# EAGLE design USB Experiment Board (EAGLE 7.6.0)
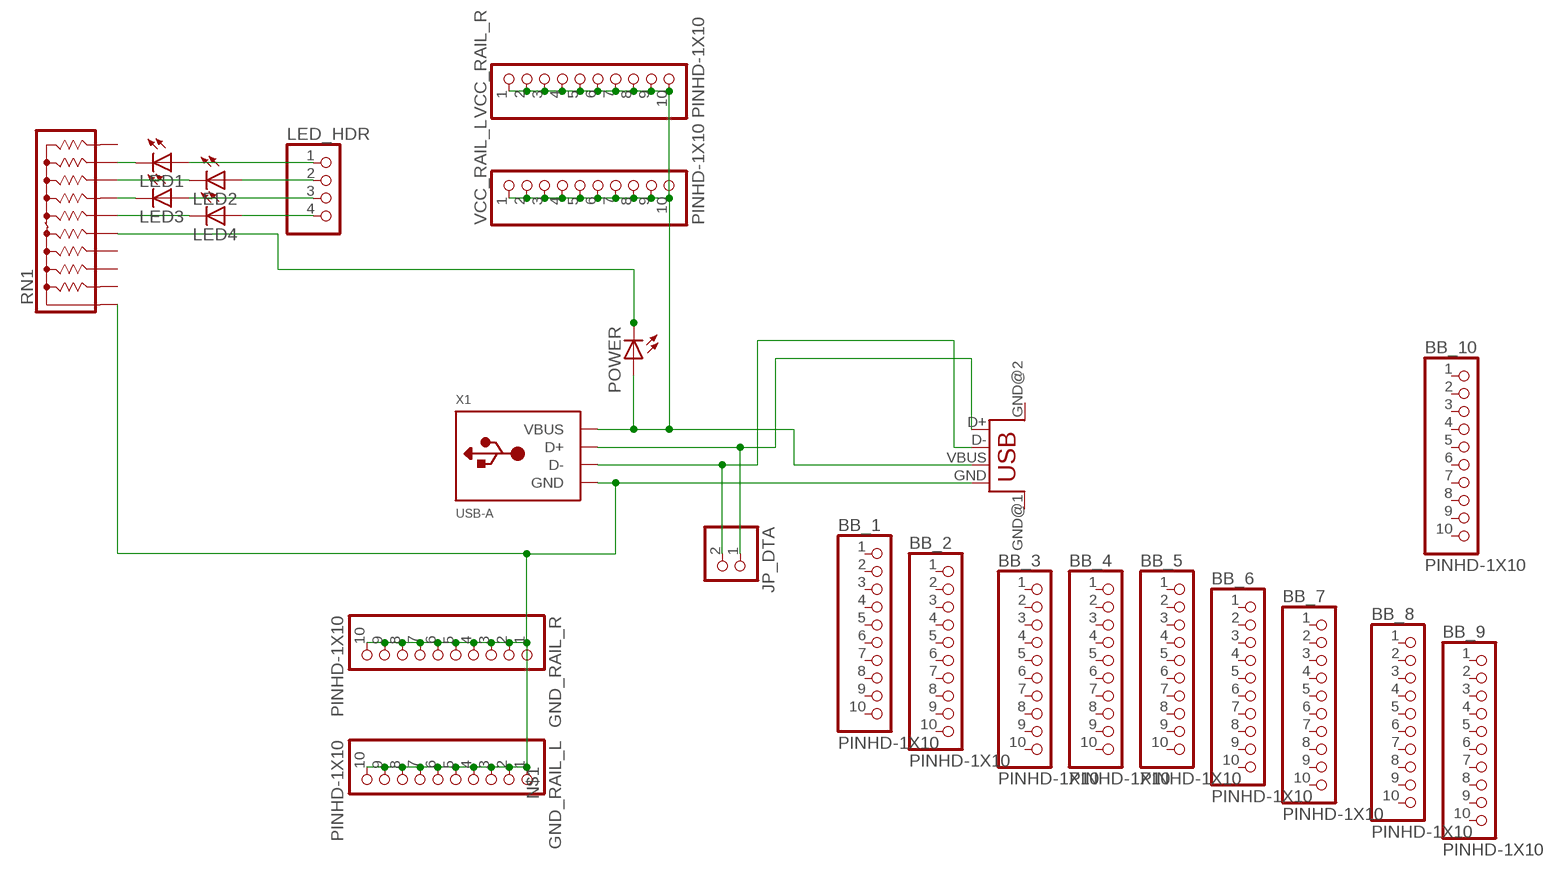
[diagram p0: schematic, sheet 1]

## Parts
BB_1  PINHD-1X10  [1X10-BIG]
BB_2  PINHD-1X10  [1X10-BIG]
BB_3  PINHD-1X10  [1X10-BIG]
BB_4  PINHD-1X10  [1X10-BIG]
BB_5  PINHD-1X10  [1X10-BIG]
BB_6  PINHD-1X10  [1X10-BIG]
BB_7  PINHD-1X10  [1X10-BIG]
BB_8  PINHD-1X10  [1X10-BIG]
BB_9  PINHD-1X10  [1X10-BIG]
BB_10  PINHD-1X10  [1X10-BIG]
GND_RAIL_L  PINHD-1X10  [1X10-BIG]
GND_RAIL_R  PINHD-1X10  [1X10-BIG]
JP_DTA  PINHD-1X2  [1X02]
LED1  LEDSMT1206  [1206]
LED2  LEDSMT1206  [1206]
LED3  LEDSMT1206  [1206]
LED4  LEDSMT1206  [1206]
LED_HDR  PINHD-1X4  [1X04]
POWER  LEDSMT1206  [1206]
RN1  4610X  [SIP10]
U$1  USB  [USB-FEMALE-A-PTH]
VCC_RAIL_L  PINHD-1X10  [1X10-BIG]
VCC_RAIL_R  PINHD-1X10  [1X10-BIG]
X1  USB-A  [MOLEX_480371000]

## Nets
N$1: GND_RAIL_L.1 GND_RAIL_L.2 GND_RAIL_L.3 GND_RAIL_L.4 GND_RAIL_L.5 GND_RAIL_L.6 GND_RAIL_L.7 GND_RAIL_L.8 GND_RAIL_L.9 GND_RAIL_L.10 GND_RAIL_R.1 GND_RAIL_R.2 GND_RAIL_R.3 GND_RAIL_R.4 GND_RAIL_R.5 GND_RAIL_R.6 GND_RAIL_R.7 GND_RAIL_R.8 GND_RAIL_R.9 GND_RAIL_R.10 RN1.1 U$1.GND X1.4(GND)
N$2: LED1.C RN1.9
N$3: JP_DTA.1 U$1.D+ X1.3(D+)
N$4: JP_DTA.2 U$1.D- X1.2(D-)
N$5: LED2.C RN1.8
N$6: LED3.C RN1.7
N$7: LED4.C RN1.6
N$8: LED1.A LED_HDR.1
N$9: LED2.A LED_HDR.2
N$10: LED3.A LED_HDR.3
N$11: LED4.A LED_HDR.4
N$13: POWER.C RN1.5
VCC: POWER.A U$1.VBUS VCC_RAIL_L.1 VCC_RAIL_L.2 VCC_RAIL_L.3 VCC_RAIL_L.4 VCC_RAIL_L.5 VCC_RAIL_L.6 VCC_RAIL_L.7 VCC_RAIL_L.8 VCC_RAIL_L.9 VCC_RAIL_L.10 VCC_RAIL_R.1 VCC_RAIL_R.2 VCC_RAIL_R.3 VCC_RAIL_R.4 VCC_RAIL_R.5 VCC_RAIL_R.6 VCC_RAIL_R.7 VCC_RAIL_R.8 VCC_RAIL_R.9 VCC_RAIL_R.10 X1.1(VBUS)
Unconnected: BB_1.1 BB_1.2 BB_1.3 BB_1.4 BB_1.5 BB_1.6 BB_1.7 BB_1.8 BB_1.9 BB_1.10 BB_2.1 BB_2.2 BB_2.3 BB_2.4 BB_2.5 BB_2.6 BB_2.7 BB_2.8 BB_2.9 BB_2.10 BB_3.1 BB_3.2 BB_3.3 BB_3.4 BB_3.5 BB_3.6 BB_3.7 BB_3.8 BB_3.9 BB_3.10 BB_4.1 BB_4.2 BB_4.3 BB_4.4 BB_4.5 BB_4.6 BB_4.7 BB_4.8 BB_4.9 BB_4.10 BB_5.1 BB_5.2 BB_5.3 BB_5.4 BB_5.5 BB_5.6 BB_5.7 BB_5.8 BB_5.9 BB_5.10 BB_6.1 BB_6.2 BB_6.3 BB_6.4 BB_6.5 BB_6.6 BB_6.7 BB_6.8 BB_6.9 BB_6.10 BB_7.1 BB_7.2 BB_7.3 BB_7.4 BB_7.5 BB_7.6 BB_7.7 BB_7.8 BB_7.9 BB_7.10 BB_8.1 BB_8.2 BB_8.3 BB_8.4 BB_8.5 BB_8.6 BB_8.7 BB_8.8 BB_8.9 BB_8.10 BB_9.1 BB_9.2 BB_9.3 BB_9.4 BB_9.5 BB_9.6 BB_9.7 BB_9.8 BB_9.9 BB_9.10 BB_10.1 BB_10.2 BB_10.3 BB_10.4 BB_10.5 BB_10.6 BB_10.7 BB_10.8 BB_10.9 BB_10.10 RN1.2 RN1.3 RN1.4 RN1.10 U$1.GND@1(GND) U$1.GND@2(GND)

## Library data of the parts
BB_1-BB_10 GND_RAIL_L GND_RAIL_R VCC_RAIL_L VCC_RAIL_R = adafruit:PINHD-1X10: Pin header 1x10 0.1" spacing With round pins
JP_DTA = pinhead:PINHD-1X2: PIN HEADER
LED1-LED4 POWER = adafruit:LED: LED OSRAM: - CHIPLED LG R971, LG N971, LY N971, LG Q971, LY Q971, LO R971, LY R971 LH N974, LH R974 LS Q976, LO Q976, LY Q976 LO Q996 - Hyper CHIPLED LW Q18S LB Q993, LB Q99A, LB R99A - SideLED LS A670, LO A670, LY A670, LG A670, LP A670 LB A673, LV A673, LT A673, LW A673 LH A674 LY A675 LS A676, LA A676, LO A676, LY A676, LW A676 LS A679, LY A679, LG A679 - Hyper Micro SIDELED® LS Y876, LA Y876, LO Y876, LY Y876 LT Y87S - SmartLED LW L88C, LW L88S LB L89C, LB L89S, LG L890 LS L89K, LO L89K, LY L89K LS L896, LA L896, LO L896, LY L896 - TOPLED LS T670, LO T670, LY T670, LG T670, LP T670 LSG T670, LSP T670, LSY T670, LOP T670, LYG T670 LG T671, LOG T671, LSG T671 LB T673, LV T673, LT T673, LW T673 LH T674 LS T676, LA T676, LO T676, LY T676, LB T676, LH T676, LSB T676, LW T676 LB T67C, LV T67C, LT T67C, LS T67K, LO T67K, LY T67K, LW E67C LS E67B, LA E67B, LO E67B, LY E67B, LB E67C, LV E67C, LT E67C LW T67C LS T679, LY T679, LG T679 LS T770, LO T770, LY T770, LG T770, LP T770 LB T773, LV T773, LT T773, LW T773 LH T774 LS E675, LA E675, LY E675, LS T675 LS T776, LA T776, LO T776, LY T776, LB T776 LHGB T686 LT T68C, LB T68C - Hyper Mini TOPLED® LB M676 - Mini TOPLED Santana® LG M470 LS M47K, LO M47K, LY M47K Source: http://www.osram.convergy.de/
LED_HDR = pinhead:PINHD-1X4: PIN HEADER
RN1 = resistor-sip:4610X: Bourns 4600X Series - Thick Film Conformal SIPs 4610X-101 Resistor Network Configuration: 101 (Bussed Resistors) Resistance range: 10 ohms to 10 Megaohms Maximum Operating Voltage: 100V Source: http://www.bourns.com/ProductLine.aspx?name=standard_thick_film_networks PDF: http://www.bourns.com/data/global/pdfs/4600X.pdf
U$1 = STUNTAZ:USB: USB Connectors USB-FEMALE-A-PTH: Through hole Female Type A Connector
X1 = adafruit:USB-A: USB type A 'plug' Used for things that can directly connect to a USB port, say USB key

## Board
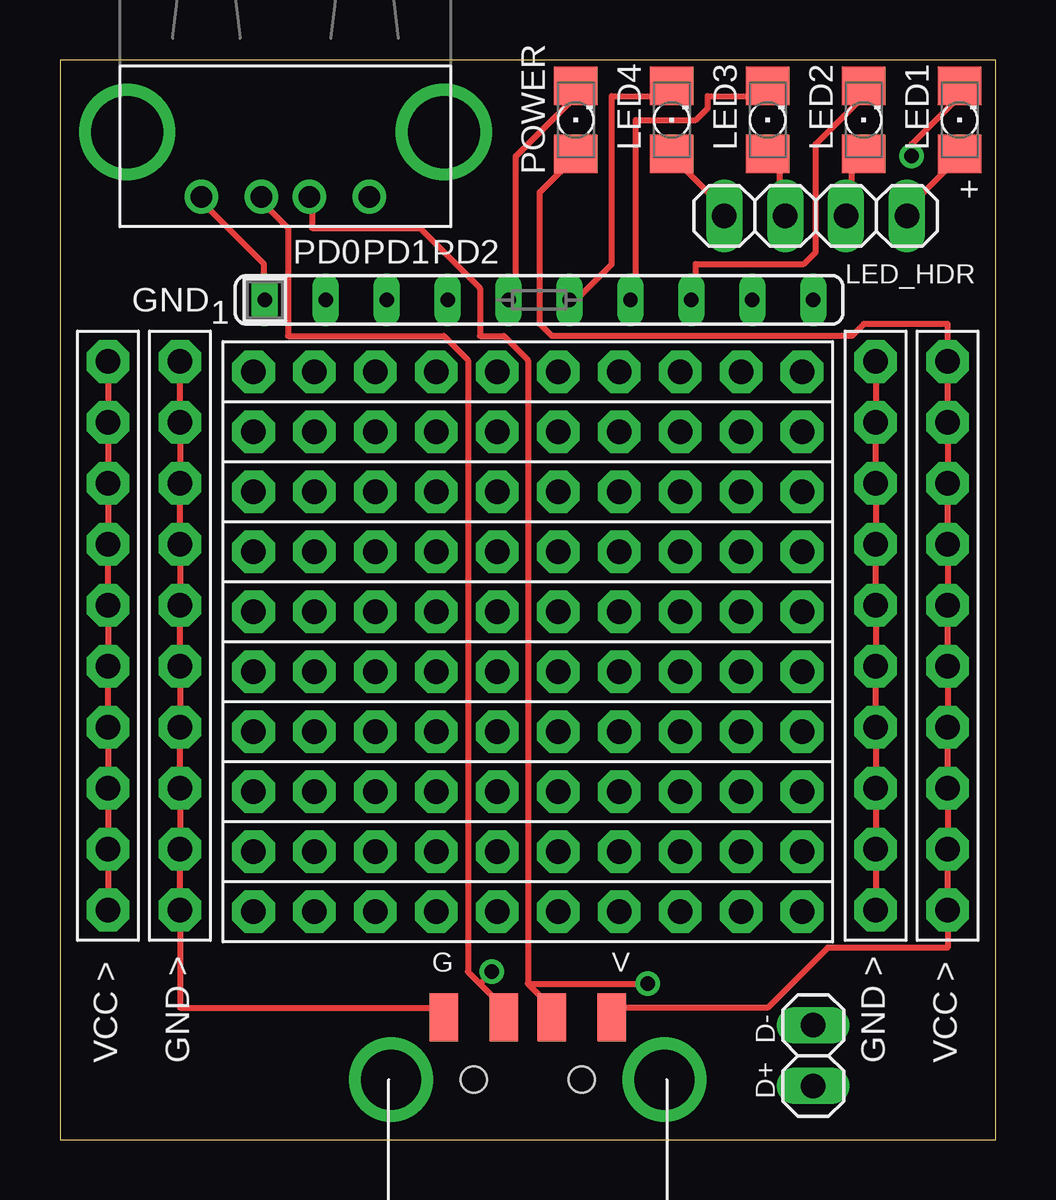
[diagram p1: board, top side]
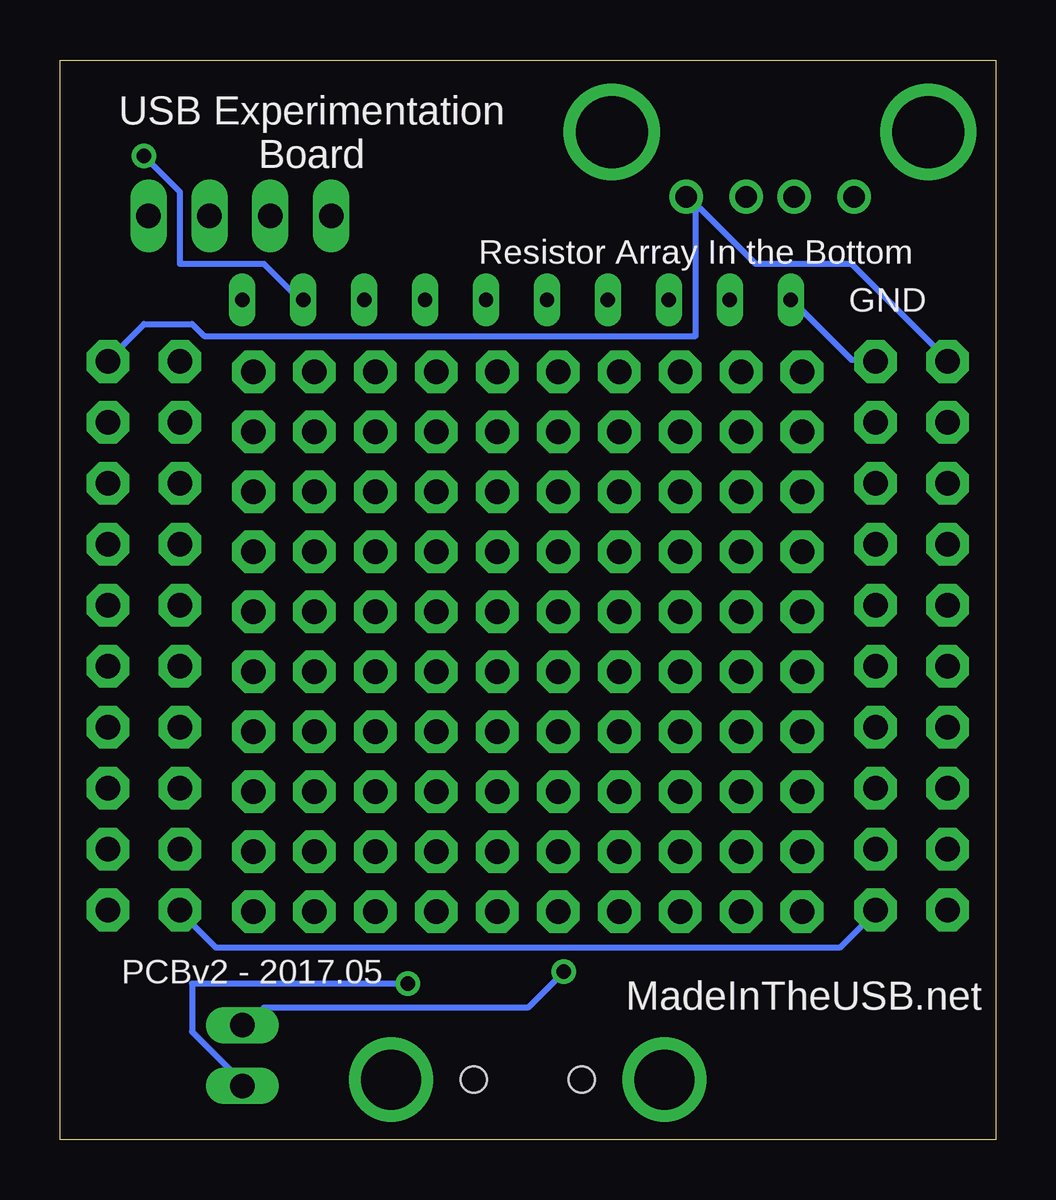
[diagram p2: board, bottom side, seen from below]

Size 39 x 45 mm. Coordinates in mm from the lower left corner, seen from the top.
Outline: 0,0 39,0 39,45 0,45 0,0
Copper layers (1*16): Top 0.035mm / dielectric 1.5mm / Bottom 0.035mm
Design rules "default": minimum track width 10mil, minimum drill 24mil, track to track 8mil, track to pad 8mil, pad to pad 8mil, via to via 8mil, smd to smd 8mil, copper to edge 40mil, drill to drill 8mil, minimum pad ring 10mil, minimum via ring 8mil, stop-mask expansion 4mil, vias tented up to drill 0mil, thermal gap 10mil

### Footprints (pad centres in the part's own frame; a part is rotated, then mirrored left to right if it is on the bottom)
1X10-BIG = drill 1.016 pad 1.778 octagon: 1 -11.43,0; 2 -8.89,0; 3 -6.35,0; 4 -3.81,0; 5 -1.27,0; 6 1.27,0; 7 3.81,0; 8 6.35,0; 9 8.89,0; 10 11.43,0
1X02 = drill 1.016 long: 1 -1.27,0; 2 1.27,0
1206 = smd 1.6 x 1.803: A -1.422,0; C 1.422,0
1X04 = drill 1.016 long: 1 -3.81,0; 2 -1.27,0; 3 1.27,0; 4 3.81,0
SIP10 = drill 0.6 long: 1 -11.46,0; 2 -8.92,0; 3 -6.38,0; 4 -3.84,0; 5 -1.3,0; 6 1.24,0; 7 3.78,0; 8 6.32,0; 9 8.86,0; 10 11.4,0
USB-FEMALE-A-PTH = drill 0.9: D+ 5.9,1.3; D- 7.9,1.3; GND 3.4,1.3; VBUS 10.4,1.3 | drill 3: GND@1 13.5,4; GND@2 0.3,4
MOLEX_480371000 = smd 1.2 x 2: 1 3.5,2.6; 2 1,2.6; 3 -1,2.6; 4 -3.5,2.6 | drill 2.5: M1 -5.7,0; M2 5.7,0 | hole 1.1: -2.25,0; 2.25,0

### Placement (x,y rotation side)
BB_1  19.5,9.5 0 top
BB_2  19.5,12 0 top
BB_3  19.5,14.5 0 top
BB_4  19.5,17 0 top
BB_5  19.5,19.5 0 top
BB_6  19.5,22 0 top
BB_7  19.5,27 0 top
BB_8  19.5,24.5 0 top
BB_9  19.5,29.5 0 top
BB_10  19.5,32 0 top
GND_RAIL_L  5,21 90 top
GND_RAIL_R  34,21 90 top
JP_DTA  31.4,3.5 270 top
LED1  37.5,42.5 90 top
LED2  33.5,42.5 90 top
LED3  29.5,42.5 90 top
LED4  25.5,42.5 90 top
LED_HDR  31.5,38.5 180 top
POWER  21.5,42.5 90 top
RN1  20,35 0 top
U$1  2.5,38 0 top
VCC_RAIL_L  2,21 90 top
VCC_RAIL_R  37,21 90 top
X1  19.5,2.5 0 top

### Tracks (layer width: path | path; a pad name or v marks a point on that pad's centre or on a via)
N$1
  Top 0.254: GND_RAIL_R.10 GND_RAIL_R.9 GND_RAIL_R.8 GND_RAIL_R.7 GND_RAIL_R.6 GND_RAIL_R.5 GND_RAIL_R.4 GND_RAIL_R.3 GND_RAIL_R.2 GND_RAIL_R.1 | U$1.GND 6,39 8.5,36.5 8.5,35 RN1.1 | X1.4 16,5.5 5,5.5 GND_RAIL_L.1 GND_RAIL_L.2 GND_RAIL_L.3 GND_RAIL_L.4 GND_RAIL_L.5 GND_RAIL_L.6 GND_RAIL_L.7 GND_RAIL_L.8 GND_RAIL_L.9 GND_RAIL_L.10
  Bottom 0.254: RN1.1 8.5,35 6,32.5 5,32.5 GND_RAIL_L.10 | GND_RAIL_R.1 34,9.5 32.5,8 6.5,8 5,9.5 GND_RAIL_L.1
N$2  (via drill 0.61)
  Top 0.254: v35.5,41 35.5,41.5 37.5,43.5 LED1.C
  Bottom 0.254: v35.5,41 34,39.5 34,36.5 30.5,36.5 29,35 RN1.9
N$3  (via drill 0.61)
  Top 0.254: 17.5,6.5 17,7 17,32.5 16,33.5 9.5,33.5 9.5,38 8.5,39 U$1.D+ | 17.5,6.5 18.5,5.5 X1.3 | 17.5,6.5 v18,7
  Bottom 0.254: v18,7 19.5,5.5 30.5,5.5 31,5 JP_DTA.1
N$4  (via drill 0.61)
  Top 0.254: 19.5,6.5 20.5,5.5 X1.2 | 19.5,6.5 19.5,32.5 18.5,33.5 17.5,33.5 17.5,35.5 15,38 10.5,38 10.5,39 U$1.D- | 19.5,6.5 v24.5,6.5
  Bottom 0.254: v24.5,6.5 33.5,6.5 33.5,4.5 31.5,2.5 JP_DTA.2
N$5
  Top 0.254: LED2.C 33.5,43.5 31.5,41.5 31.5,37 31,36.5 26.5,36.5 26.5,35 RN1.8
N$6
  Top 0.254: LED3.C 29.5,43.5 27,43.5 27,43 26.5,42.5 24,42.5 24,35 RN1.7
N$7
  Top 0.254: LED4.C 25.5,43.5 23,43.5 23,36.5 21.5,35 RN1.6
N$8
  Top 0.254: LED1.A 37.5,41 35.5,39 35.5,38.5 LED_HDR.1
N$9
  Top 0.254: LED2.A 33.5,41 33,40.5 33,38.5 LED_HDR.2
N$10
  Top 0.254: LED3.A 29.5,41 30,40.5 30,38.5 LED_HDR.3
N$11
  Top 0.254: LED4.A 25.5,41 27.5,39 27.5,38.5 LED_HDR.4
N$13
  Top 0.254: POWER.C 21.5,43.5 19,41 19,35 RN1.5
VCC
  Top 0.254: VCC_RAIL_L.1 VCC_RAIL_L.2 VCC_RAIL_L.3 VCC_RAIL_L.4 VCC_RAIL_L.5 VCC_RAIL_L.6 VCC_RAIL_L.7 VCC_RAIL_L.8 VCC_RAIL_L.9 VCC_RAIL_L.10 | POWER.A 21.5,41 20,39.5 20,34 20.5,33.5 33,33.5 33.5,34 37,34 VCC_RAIL_R.10 VCC_RAIL_R.9 VCC_RAIL_R.8 VCC_RAIL_R.7 VCC_RAIL_R.6 VCC_RAIL_R.5 VCC_RAIL_R.4 VCC_RAIL_R.3 VCC_RAIL_R.2 VCC_RAIL_R.1 37,8 32,8 29.5,5.5 23,5.5 X1.1
  Bottom 0.254: 12.5,39 10,36.5 6,36.5 2,32.5 VCC_RAIL_L.10 | 12.5,39 12.5,33.5 33,33.5 33.5,34 35.5,34 37,32.5 VCC_RAIL_R.10 | 12.5,39 U$1.VBUS

### Text on the board
tNames: + | PD0 | PD1 | PD2 | GND | G | V | D- | VCC > | GND > | GND > | VCC > | D+
bNames: USB Experimentation / Board | Resistor Array In the Bottom | GND | PCBv2 - 2017.05 | MadeInTheUSB.net